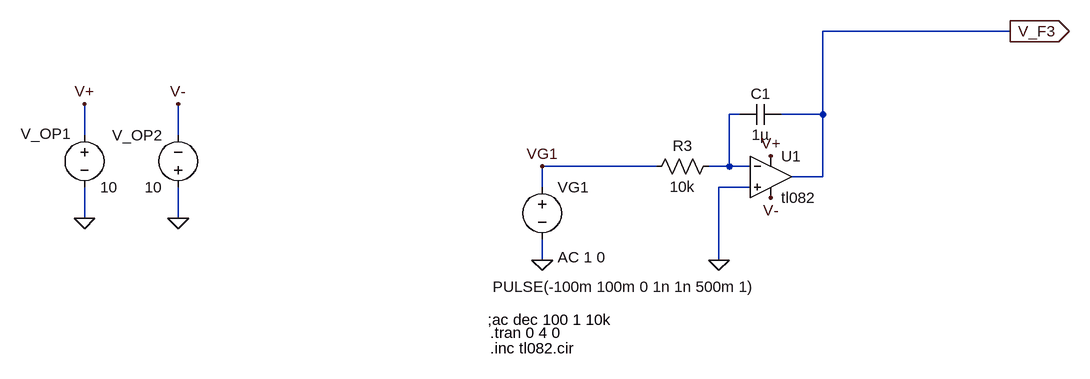
[diagram p0: schematic Integrator_Rechteck.asc]
Integrator_Rechteck.asc, the LTspice schematic file:
Version 4
SHEET 1 964 680
WIRE 848 -112 560 -112
WIRE 432 16 416 16
WIRE 560 16 560 -112
WIRE 560 16 496 16
WIRE -576 48 -576 0
WIRE -432 48 -432 0
WIRE 304 96 128 96
WIRE 416 96 416 16
WIRE 416 96 384 96
WIRE 448 96 416 96
WIRE 560 112 560 16
WIRE 560 112 512 112
WIRE 128 128 128 96
WIRE 448 128 400 128
WIRE -576 176 -576 128
WIRE -432 176 -432 128
WIRE 128 240 128 208
WIRE 400 240 400 128
FLAG 400 240 0
FLAG 480 80 V+
FLAG 480 144 V-
FLAG 848 -112 V_F3
IOPIN 848 -112 Out
FLAG 128 240 0
FLAG -432 176 0
FLAG -576 176 0
FLAG -576 0 V+
FLAG -432 0 V-
FLAG 128 96 VG1
SYMBOL Opamps\\opamp2 480 48 R0
SYMATTR InstName U1
SYMATTR Value tl082
SYMBOL res 400 80 R90
WINDOW 0 0 56 VBottom 2
WINDOW 3 32 56 VTop 2
SYMATTR InstName R3
SYMATTR Value 10k
SYMBOL cap 496 0 R90
WINDOW 0 0 32 VBottom 2
WINDOW 3 32 32 VTop 2
SYMATTR InstName C1
SYMATTR Value 1µ
SYMBOL voltage 128 112 R0
WINDOW 3 -76 169 Left 2
WINDOW 123 24 124 Left 2
WINDOW 39 0 0 Left 0
SYMATTR Value PULSE(-100m 100m 0 1n 1n 500m 1)
SYMATTR Value2 AC 1 0
SYMATTR InstName VG1
SYMBOL voltage -576 32 R0
WINDOW 123 0 0 Left 0
WINDOW 39 0 0 Left 0
WINDOW 0 -98 14 Left 2
SYMATTR InstName V_OP1
SYMATTR Value 10
SYMBOL voltage -432 144 R180
WINDOW 0 24 96 Left 2
WINDOW 3 24 16 Left 2
WINDOW 123 0 0 Left 0
WINDOW 39 0 0 Left 0
SYMATTR InstName V_OP2
SYMATTR Value 10
TEXT 48 352 Left 2 !.tran 0 4 0
TEXT 48 376 Left 2 !.inc tl082.cir
TEXT 44 332 Left 2 !;ac dec 100 1 10k

The netlist it stands for:
* Integrator_Rechteck.asc
XU1 0 N001 V+ V- V_F3 tl082  ; pins In+ In- V+ V- OUT
R3 N001 VG1 10k
C1 V_F3 N001 1µ
VG1 VG1 0 PULSE(-100m 100m 0 1n 1n 500m 1) AC 1 0
V_OP1 V+ 0 10
V_OP2 0 V- 10
.tran 0 4 0
.inc tl082.cir
;ac dec 100 1 10k
.backanno
.end